# Altium schematic sheet FPGA.SCHDOC
size B; PageSetup: Record=PageOptions|CenterHorizontal=True|CenterVertical=True|PrintScale=1.12|XCorrection=1.00|YCorrection=1.00|PrintKind=1|BorderSize=5000000|LeftOffset=0|BottomOffset=0|Orientation=2|PaperLength=1000|PaperWidth=1000|Scale=100|PaperSource=7|PrintQuality=600|MediaType=1|DitherType=10|PaperKind=Tabloid|PrintScaleMode=1
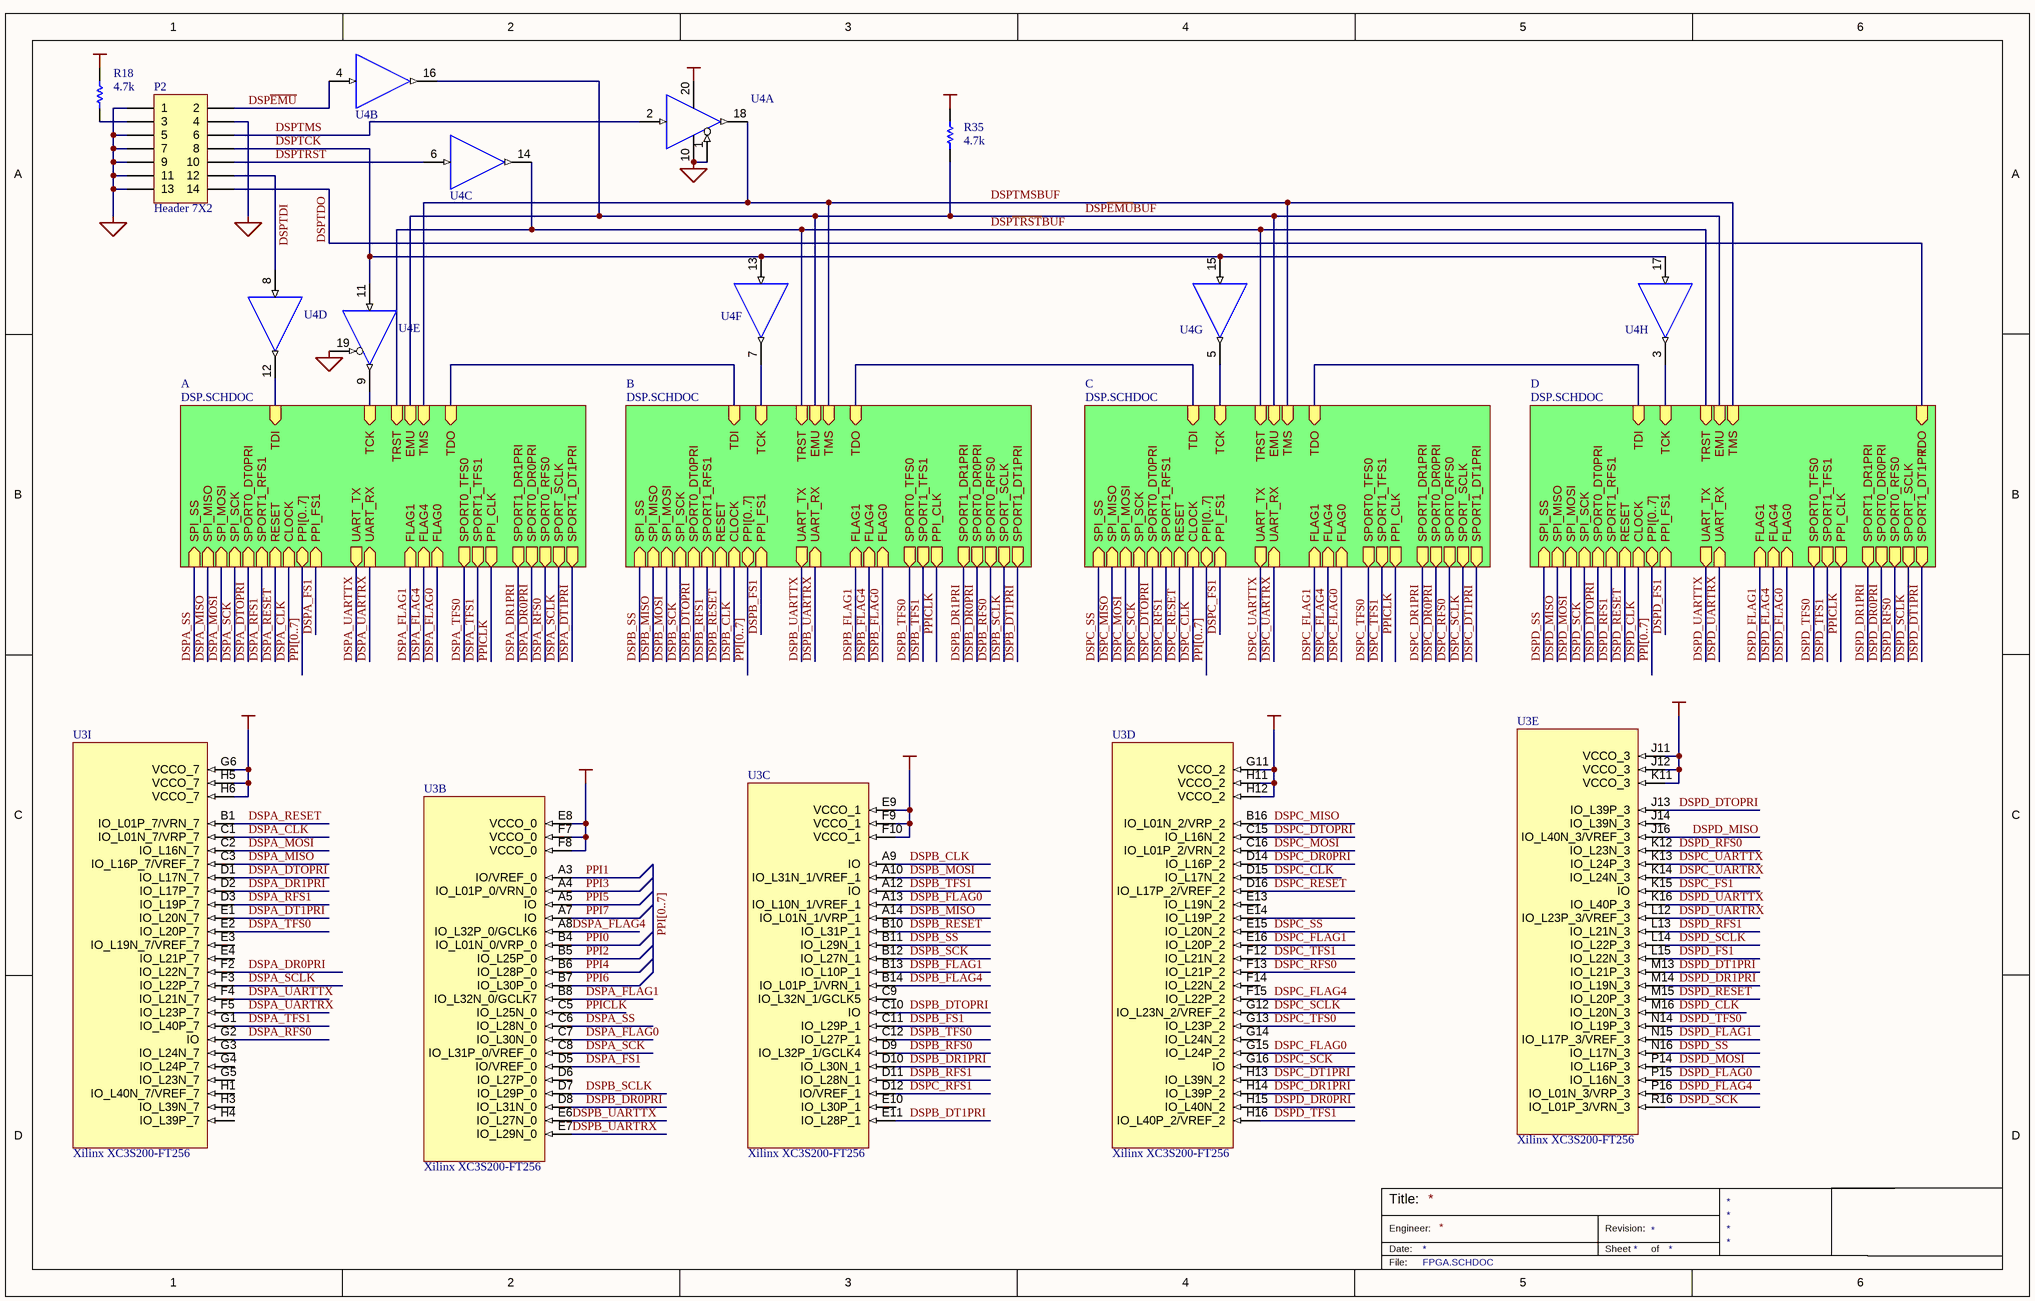
[diagram p0: FPGA.SCHDOC]

## Parts
P2  Header 7X2  [HDR2X7]
R18  value 4.7k  [0603]  (hidden comment: RESISTOR)
R35  value 4.7k  [0603]  (hidden comment: RESISTOR)
U3  Xilinx XC3S200-FT256  [Xilinx FT256 BGA]  (parts B,C,D,E,I of 9)
U4  SN54LVTH244A  [RGY]  (value not drawn)  (parts A,B,C,D,E,F,G,H of 8)

## Sub-sheets
A = DSP.SCHDOC: SPI_SS (in), SPI_MISO (in), SPI_MOSI (in), SPI_SCK (in), SPORT_SCLK (out), SPORT0_RFS0 (out), SPORT0_DR0PRI (out), SPORT1_DR1PRI (out), SPORT1_TFS1 (out), SPORT0_TFS0 (out), SPORT0_DT0PRI (in), SPORT1_RFS1 (in), RESET (in), CLOCK (in), PPI_CLK (out), PPI[0..7] (bidir), PPI_FS1 (in), TCK (in), TDI (in), TRST (in), EMU (in), TMS (in), TDO (in), FLAG1 (in), FLAG4 (in), FLAG0 (in), SPORT1_DT1PRI (out), UART_TX (out), UART_RX (in)
B = DSP.SCHDOC: SPI_SS (in), SPI_MISO (in), SPI_MOSI (in), SPI_SCK (in), SPORT_SCLK (out), SPORT0_RFS0 (out), SPORT0_DR0PRI (out), SPORT1_DR1PRI (out), SPORT1_TFS1 (out), SPORT0_TFS0 (out), SPORT0_DT0PRI (in), SPORT1_RFS1 (in), RESET (in), CLOCK (in), PPI_CLK (out), PPI[0..7] (bidir), PPI_FS1 (in), TCK (in), TDI (in), TRST (in), EMU (in), TMS (in), TDO (in), FLAG1 (in), FLAG4 (in), FLAG0 (in), SPORT1_DT1PRI (out), UART_TX (out), UART_RX (in)
C = DSP.SCHDOC: SPI_SS (in), SPI_MISO (in), SPI_MOSI (in), SPI_SCK (in), SPORT_SCLK (out), SPORT0_RFS0 (out), SPORT0_DR0PRI (out), SPORT1_DR1PRI (out), SPORT1_TFS1 (out), SPORT0_TFS0 (out), SPORT0_DT0PRI (in), SPORT1_RFS1 (in), RESET (in), CLOCK (in), PPI_CLK (out), PPI[0..7] (bidir), PPI_FS1 (in), TCK (in), TDI (in), TRST (in), EMU (in), TMS (in), TDO (in), FLAG1 (in), FLAG4 (in), FLAG0 (in), SPORT1_DT1PRI (out), UART_TX (out), UART_RX (in)
D = DSP.SCHDOC: SPI_SS (in), SPI_MISO (in), SPI_MOSI (in), SPI_SCK (in), SPORT_SCLK (out), SPORT0_RFS0 (out), SPORT0_DR0PRI (out), SPORT1_DR1PRI (out), SPORT1_TFS1 (out), SPORT0_TFS0 (out), SPORT0_DT0PRI (in), SPORT1_RFS1 (in), RESET (in), CLOCK (in), PPI_CLK (out), PPI[0..7] (bidir), PPI_FS1 (in), TCK (in), TDI (in), TRST (in), EMU (in), TMS (in), TDO (in), FLAG1 (in), FLAG4 (in), FLAG0 (in), SPORT1_DT1PRI (out), UART_TX (out), UART_RX (in)

## Nets
GND: P2.1 P2.4 P2.5 P2.7 P2.9 P2.11 P2.13 U4.1(~{1OE}) U4.10(GND) U4.19(~{2OE})
VCC: R18.2 R35.2 U3.E8(VCCO_0) U3.E9(VCCO_1) U3.F7(VCCO_0) U3.F8(VCCO_0) U3.F9(VCCO_1) U3.F10(VCCO_1) U3.G6(VCCO_7) U3.G11(VCCO_2) U3.H5(VCCO_7) U3.H6(VCCO_7) U3.H11(VCCO_2) U3.H12(VCCO_2) U3.J11(VCCO_3) U3.J12(VCCO_3) U3.K11(VCCO_3) U4.20(VCC)
DSPA_CLK: U3.C1(IO_L01N_7/VRP_7) ; sheet A/CLOCK
DSPA_DR0PRI: U3.F2(IO_L22N_7) ; sheet A/SPORT0_DR0PRI
DSPA_DR1PRI: U3.D2(IO_L17P_7) ; sheet A/SPORT1_DR1PRI
DSPA_DT1PRI: U3.E1(IO_L20N_7) ; sheet A/SPORT1_DT1PRI
DSPA_DTOPRI: U3.D1(IO_L17N_7) ; sheet A/SPORT0_DT0PRI
DSPA_FLAG0: U3.C7(IO_L30N_0) ; sheet A/FLAG0
DSPA_FLAG1: U3.B8(IO_L32N_0/GCLK7) ; sheet A/FLAG1
DSPA_FLAG4: U3.A8(IO_L32P_0/GCLK6) ; sheet A/FLAG4
DSPA_FS1: U3.D5(IO/VREF_0) ; sheet A/PPI_FS1
DSPA_MISO: U3.C3(IO_L16P_7/VREF_7) ; sheet A/SPI_MISO
DSPA_MOSI: U3.C2(IO_L16N_7) ; sheet A/SPI_MOSI
DSPA_RESET: U3.B1(IO_L01P_7/VRN_7) ; sheet A/RESET
DSPA_RFS0: U3.G2(IO) ; sheet A/SPORT0_RFS0
DSPA_RFS1: U3.D3(IO_L19P_7) ; sheet A/SPORT1_RFS1
DSPA_SCK: U3.C8(IO_L31P_0/VREF_0) ; sheet A/SPI_SCK
DSPA_SCLK: U3.F3(IO_L22P_7) ; sheet A/SPORT_SCLK
DSPA_SS: U3.C6(IO_L28N_0) ; sheet A/SPI_SS
DSPA_TFS0: U3.E2(IO_L20P_7) ; sheet A/SPORT0_TFS0
DSPA_TFS1: U3.G1(IO_L40P_7) ; sheet A/SPORT1_TFS1
DSPA_UARTRX: U3.F5(IO_L23P_7) ; sheet A/UART_RX
DSPA_UARTTX: U3.F4(IO_L21N_7) ; sheet A/UART_TX
DSPB_CLK: U3.A9(IO) ; sheet B/CLOCK
DSPB_DR0PRI: U3.D8(IO_L31N_0) ; sheet B/SPORT0_DR0PRI
DSPB_DR1PRI: U3.D10(IO_L30N_1) ; sheet B/SPORT1_DR1PRI
DSPB_DT1PRI: U3.E11(IO_L28P_1) ; sheet B/SPORT1_DT1PRI
DSPB_DTOPRI: U3.C10(IO) ; sheet B/SPORT0_DT0PRI
DSPB_FLAG0: U3.A13(IO_L10N_1/VREF_1) ; sheet B/FLAG0
DSPB_FLAG1: U3.B13(IO_L10P_1) ; sheet B/FLAG1
DSPB_FLAG4: U3.B14(IO_L01P_1/VRN_1) ; sheet B/FLAG4
DSPB_FS1: U3.C11(IO_L29P_1) ; sheet B/PPI_FS1
DSPB_MISO: U3.A14(IO_L01N_1/VRP_1) ; sheet B/SPI_MISO
DSPB_MOSI: U3.A10(IO_L31N_1/VREF_1) ; sheet B/SPI_MOSI
DSPB_RESET: U3.B10(IO_L31P_1) ; sheet B/RESET
DSPB_RFS0: U3.D9(IO_L32P_1/GCLK4) ; sheet B/SPORT0_RFS0
DSPB_RFS1: U3.D11(IO_L28N_1) ; sheet B/SPORT1_RFS1
DSPB_SCK: U3.B12(IO_L27N_1) ; sheet B/SPI_SCK
DSPB_SCLK: U3.D7(IO_L29P_0) ; sheet B/SPORT_SCLK
DSPB_SS: U3.B11(IO_L29N_1) ; sheet B/SPI_SS
DSPB_TFS0: U3.C12(IO_L27P_1) ; sheet B/SPORT0_TFS0
DSPB_TFS1: U3.A12(IO) ; sheet B/SPORT1_TFS1
DSPB_UARTRX: U3.E7(IO_L29N_0) ; sheet B/UART_RX
DSPB_UARTTX: U3.E6(IO_L27N_0) ; sheet B/UART_TX
DSPC_CLK: U3.D15(IO_L17N_2) ; sheet C/CLOCK
DSPC_DR0PRI: U3.D14(IO_L16P_2) ; sheet C/SPORT0_DR0PRI
DSPC_DR1PRI: U3.H14(IO_L39P_2) ; sheet C/SPORT1_DR1PRI
DSPC_DT1PRI: U3.H13(IO_L39N_2) ; sheet C/SPORT1_DT1PRI
DSPC_DTOPRI: U3.C15(IO_L16N_2) ; sheet C/SPORT0_DT0PRI
DSPC_FLAG0: U3.G15(IO_L24P_2) ; sheet C/FLAG0
DSPC_FLAG1: U3.E16(IO_L20P_2) ; sheet C/FLAG1
DSPC_FLAG4: U3.F15(IO_L22P_2) ; sheet C/FLAG4
DSPC_FS1: U3.K15(IO) ; sheet C/PPI_FS1
DSPC_MISO: U3.B16(IO_L01N_2/VRP_2) ; sheet C/SPI_MISO
DSPC_MOSI: U3.C16(IO_L01P_2/VRN_2) ; sheet C/SPI_MOSI
DSPC_RESET: U3.D16(IO_L17P_2/VREF_2) ; sheet C/RESET
DSPC_RFS0: U3.F13(IO_L21P_2) ; sheet C/SPORT0_RFS0
DSPC_RFS1: U3.D12(IO/VREF_1) ; sheet C/SPORT1_RFS1
DSPC_SCK: U3.G16(IO) ; sheet C/SPI_SCK
DSPC_SCLK: U3.G12(IO_L23N_2/VREF_2) ; sheet C/SPORT_SCLK
DSPC_SS: U3.E15(IO_L20N_2) ; sheet C/SPI_SS
DSPC_TFS0: U3.G13(IO_L23P_2) ; sheet C/SPORT0_TFS0
DSPC_TFS1: U3.F12(IO_L21N_2) ; sheet C/SPORT1_TFS1
DSPC_UARTRX: U3.K14(IO_L24N_3) ; sheet C/UART_RX
DSPC_UARTTX: U3.K13(IO_L24P_3) ; sheet C/UART_TX
DSPD_CLK: U3.M16(IO_L20N_3) ; sheet D/CLOCK
DSPD_DR0PRI: U3.H15(IO_L40N_2) ; sheet D/SPORT0_DR0PRI
DSPD_DR1PRI: U3.M14(IO_L19N_3) ; sheet D/SPORT1_DR1PRI
DSPD_DT1PRI: U3.M13(IO_L21P_3) ; sheet D/SPORT1_DT1PRI
DSPD_DTOPRI: U3.J13(IO_L39P_3) ; sheet D/SPORT0_DT0PRI
DSPD_FLAG0: U3.P15(IO_L16N_3) ; sheet D/FLAG0
DSPD_FLAG1: U3.N15(IO_L17P_3/VREF_3) ; sheet D/FLAG1
DSPD_FLAG4: U3.P16(IO_L01N_3/VRP_3) ; sheet D/FLAG4
DSPD_FS1: U3.L15(IO_L22N_3) ; sheet D/PPI_FS1
DSPD_MISO: U3.J16(IO_L40N_3/VREF_3) ; sheet D/SPI_MISO
DSPD_MOSI: U3.P14(IO_L16P_3) ; sheet D/SPI_MOSI
DSPD_RESET: U3.M15(IO_L20P_3) ; sheet D/RESET
DSPD_RFS0: U3.K12(IO_L23N_3) ; sheet D/SPORT0_RFS0
DSPD_RFS1: U3.L13(IO_L21N_3) ; sheet D/SPORT1_RFS1
DSPD_SCK: U3.R16(IO_L01P_3/VRN_3) ; sheet D/SPI_SCK
DSPD_SCLK: U3.L14(IO_L22P_3) ; sheet D/SPORT_SCLK
DSPD_SS: U3.N16(IO_L17N_3) ; sheet D/SPI_SS
DSPD_TFS0: U3.N14(IO_L19P_3) ; sheet D/SPORT0_TFS0
DSPD_TFS1: U3.H16(IO_L40P_2/VREF_2) ; sheet D/SPORT1_TFS1
DSPD_UARTRX: U3.L12(IO_L23P_3/VREF_3) ; sheet D/UART_RX
DSPD_UARTTX: U3.K16(IO_L40P_3) ; sheet D/UART_TX
DSP~{EMU}: P2.2 U4.4(IN)
DSP~{EMU}BUF: R35.1 U4.16(OUT) ; sheet A/EMU, sheet B/EMU, sheet C/EMU, sheet D/EMU
DSP~{TRST}: P2.10 U4.6(IN)
DSP~{TRST}BUF: U4.14(OUT) ; sheet A/TRST, sheet B/TRST, sheet C/TRST, sheet D/TRST
DSPTCK: P2.8 U4.11(IN) U4.13(IN) U4.15(IN) U4.17(IN)
DSPTDI: P2.12 U4.8(IN)
DSPTDO: P2.14 ; sheet D/TDO
DSPTMS: P2.6 U4.2(IN)
DSPTMSBUF: U4.18(OUT) ; sheet A/TMS, sheet B/TMS, sheet C/TMS, sheet D/TMS
PPI0: U3.B4(IO_L01N_0/VRP_0)
PPI1: U3.A3(IO/VREF_0)
PPI2: U3.B5(IO_L25P_0)
PPI3: U3.A4(IO_L01P_0/VRN_0)
PPI4: U3.B6(IO_L28P_0)
PPI5: U3.A5(IO)
PPI6: U3.B7(IO_L30P_0)
PPI7: U3.A7(IO)
PPICLK: U3.C5(IO_L25N_0) ; sheet A/PPI_CLK, sheet B/PPI_CLK, sheet C/PPI_CLK, sheet D/PPI_CLK
NetP2_3: P2.3 R18.1
NetU4_3: U4.3(OUT) ; sheet D/TCK
NetU4_5: U4.5(OUT) ; sheet C/TCK
NetU4_7: U4.7(OUT) ; sheet B/TCK
NetU4_9: U4.9(OUT) ; sheet A/TCK
NetU4_12: U4.12(OUT) ; sheet A/TDI
(unnamed): sheet A/TDO, sheet B/TDI
(unnamed): sheet B/TDO, sheet C/TDI
(unnamed): sheet C/TDO, sheet D/TDI

Not connected (* = marked no-connect by the designer): U3 C9(IO_L32N_1/GCLK5) D6(IO_L27P_0) E3(IO_L19N_7/VREF_7) E4(IO_L21P_7) E10(IO_L30P_1) E13(IO_L19N_2) E14(IO_L19P_2) F14(IO_L22N_2) G3(IO_L24N_7) G4(IO_L24P_7) G5(IO_L23N_7) G14(IO_L24N_2) H1(IO_L40N_7/VREF_7) H3(IO_L39N_7) H4(IO_L39P_7) J14(IO_L39N_3)

## Buses and harness runs
bus PPI[0..7]
bus PPI[0..7] = sheet A/PPI[0..7]
bus PPI[0..7] = sheet B/PPI[0..7]
bus PPI[0..7] = sheet C/PPI[0..7]
bus PPI[0..7] = sheet D/PPI[0..7]

## Notes on the sheet
- Title:
- Engineer:
- Date:
- Revision:
- Sheet
- of
- File:

## Library data of the parts
P2 = Header 7X2: Header, 7-Pin, Dual row; LatestRevisionDate: 17-Jul-2002; LatestRevisionNote: Re-released for DXP Platform.; Publisher: Altium Limited
R18 R35 = RESISTOR: Standard Passive Resistor; Tolerance: 1%
U3 = XC3S200-FT256: Xilinx Spartan-3 FPGA